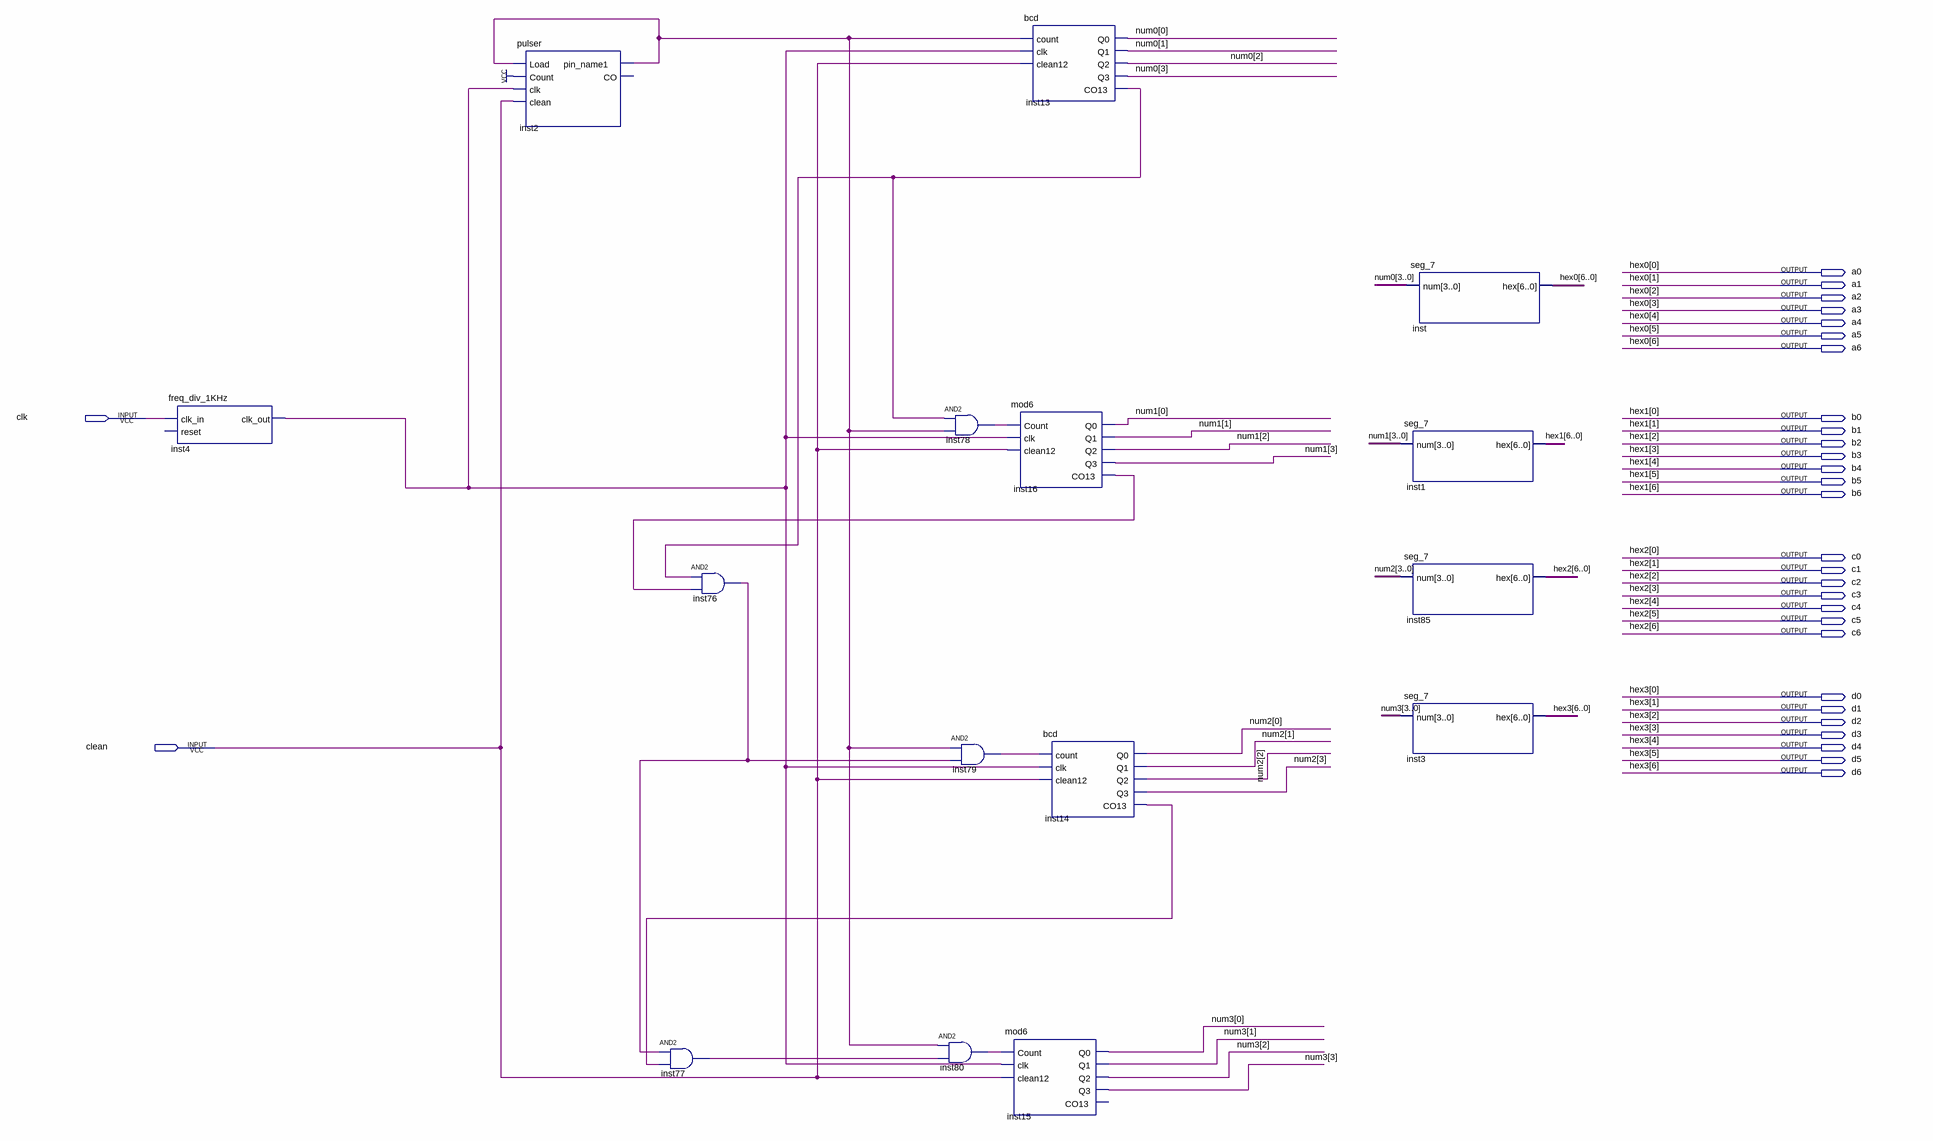
[diagram p0: schematic sheet]
// Quartus schematic midterm.bdf as structural Verilog: 15 symbols, 30 pins
module midterm (
  input  clk,
  input  clean,
  output a0,
  output a1,
  output a2,
  output a3,
  output a4,
  output a5,
  output a6,
  output b0,
  output b1,
  output b2,
  output b3,
  output b4,
  output b5,
  output b6,
  output c0,
  output c1,
  output c2,
  output c3,
  output c4,
  output c5,
  output c6,
  output d0,
  output d1,
  output d2,
  output d3,
  output d4,
  output d5,
  output d6
);

  wire inst2_pin_name1, inst4_clk_out, inst13_co13, inst14_co13, inst16_co13, inst76_out, inst77_out,
       inst78_out, inst79_out, inst80_out;
  wire [3:0] num0, num1, num2, num3;

  freq_div_1KHz inst4 (.clk_in(clk), .clk_out(inst4_clk_out));  // open: reset
  pulser inst2 (
    .Load(inst2_pin_name1), .Count(1'b1), .clk(inst4_clk_out), .clean(clean), .pin_name1(inst2_pin_name1));  // open: CO
  and inst77 (inst77_out, inst76_out, inst14_co13);
  and inst76 (inst76_out, inst13_co13, inst16_co13);
  and inst78 (inst78_out, inst13_co13, inst2_pin_name1);
  and inst79 (inst79_out, inst2_pin_name1, inst76_out);
  and inst80 (inst80_out, inst2_pin_name1, inst77_out);
  mod6 inst16 (
    .Count(inst78_out), .clk(inst4_clk_out), .clean12(clean), .Q0(num1[0]), .Q1(num1[1]), .Q2(num1[2]),
    .Q3(num1[3]), .CO13(inst16_co13));
  mod6 inst15 (
    .Count(inst80_out), .clk(inst4_clk_out), .clean12(clean), .Q0(num3[0]), .Q1(num3[1]), .Q2(num3[2]),
    .Q3(num3[3]));  // open: CO13
  bcd inst13 (
    .count(inst2_pin_name1), .clk(inst4_clk_out), .clean12(clean), .Q0(num0[0]), .Q1(num0[1]), .Q2(num0[2]),
    .Q3(num0[3]), .CO13(inst13_co13));
  bcd inst14 (
    .count(inst79_out), .clk(inst4_clk_out), .clean12(clean), .Q0(num2[0]), .Q1(num2[1]), .Q2(num2[2]),
    .Q3(num2[3]), .CO13(inst14_co13));
  seg_7 inst (.num(num0), .hex({a6, a5, a4, a3, a2, a1, a0}));
  seg_7 inst1 (.num(num1), .hex({b6, b5, b4, b3, b2, b1, b0}));
  seg_7 inst85 (.num(num2), .hex({c6, c5, c4, c3, c2, c1, c0}));
  seg_7 inst3 (.num(num3), .hex({d6, d5, d4, d3, d2, d1, d0}));

  // Other names for the same wires on the sheet: hex0[6:0] = {a6, a5, a4, a3, a2, a1, a0};
  //   hex1[6:0] = {b6, b5, b4, b3, b2, b1, b0}; hex2[6:0] = {c6, c5, c4, c3, c2, c1, c0};
  //   hex3[6:0] = {d6, d5, d4, d3, d2, d1, d0}
endmodule
